# Altium project Main Nova.PrjPcb
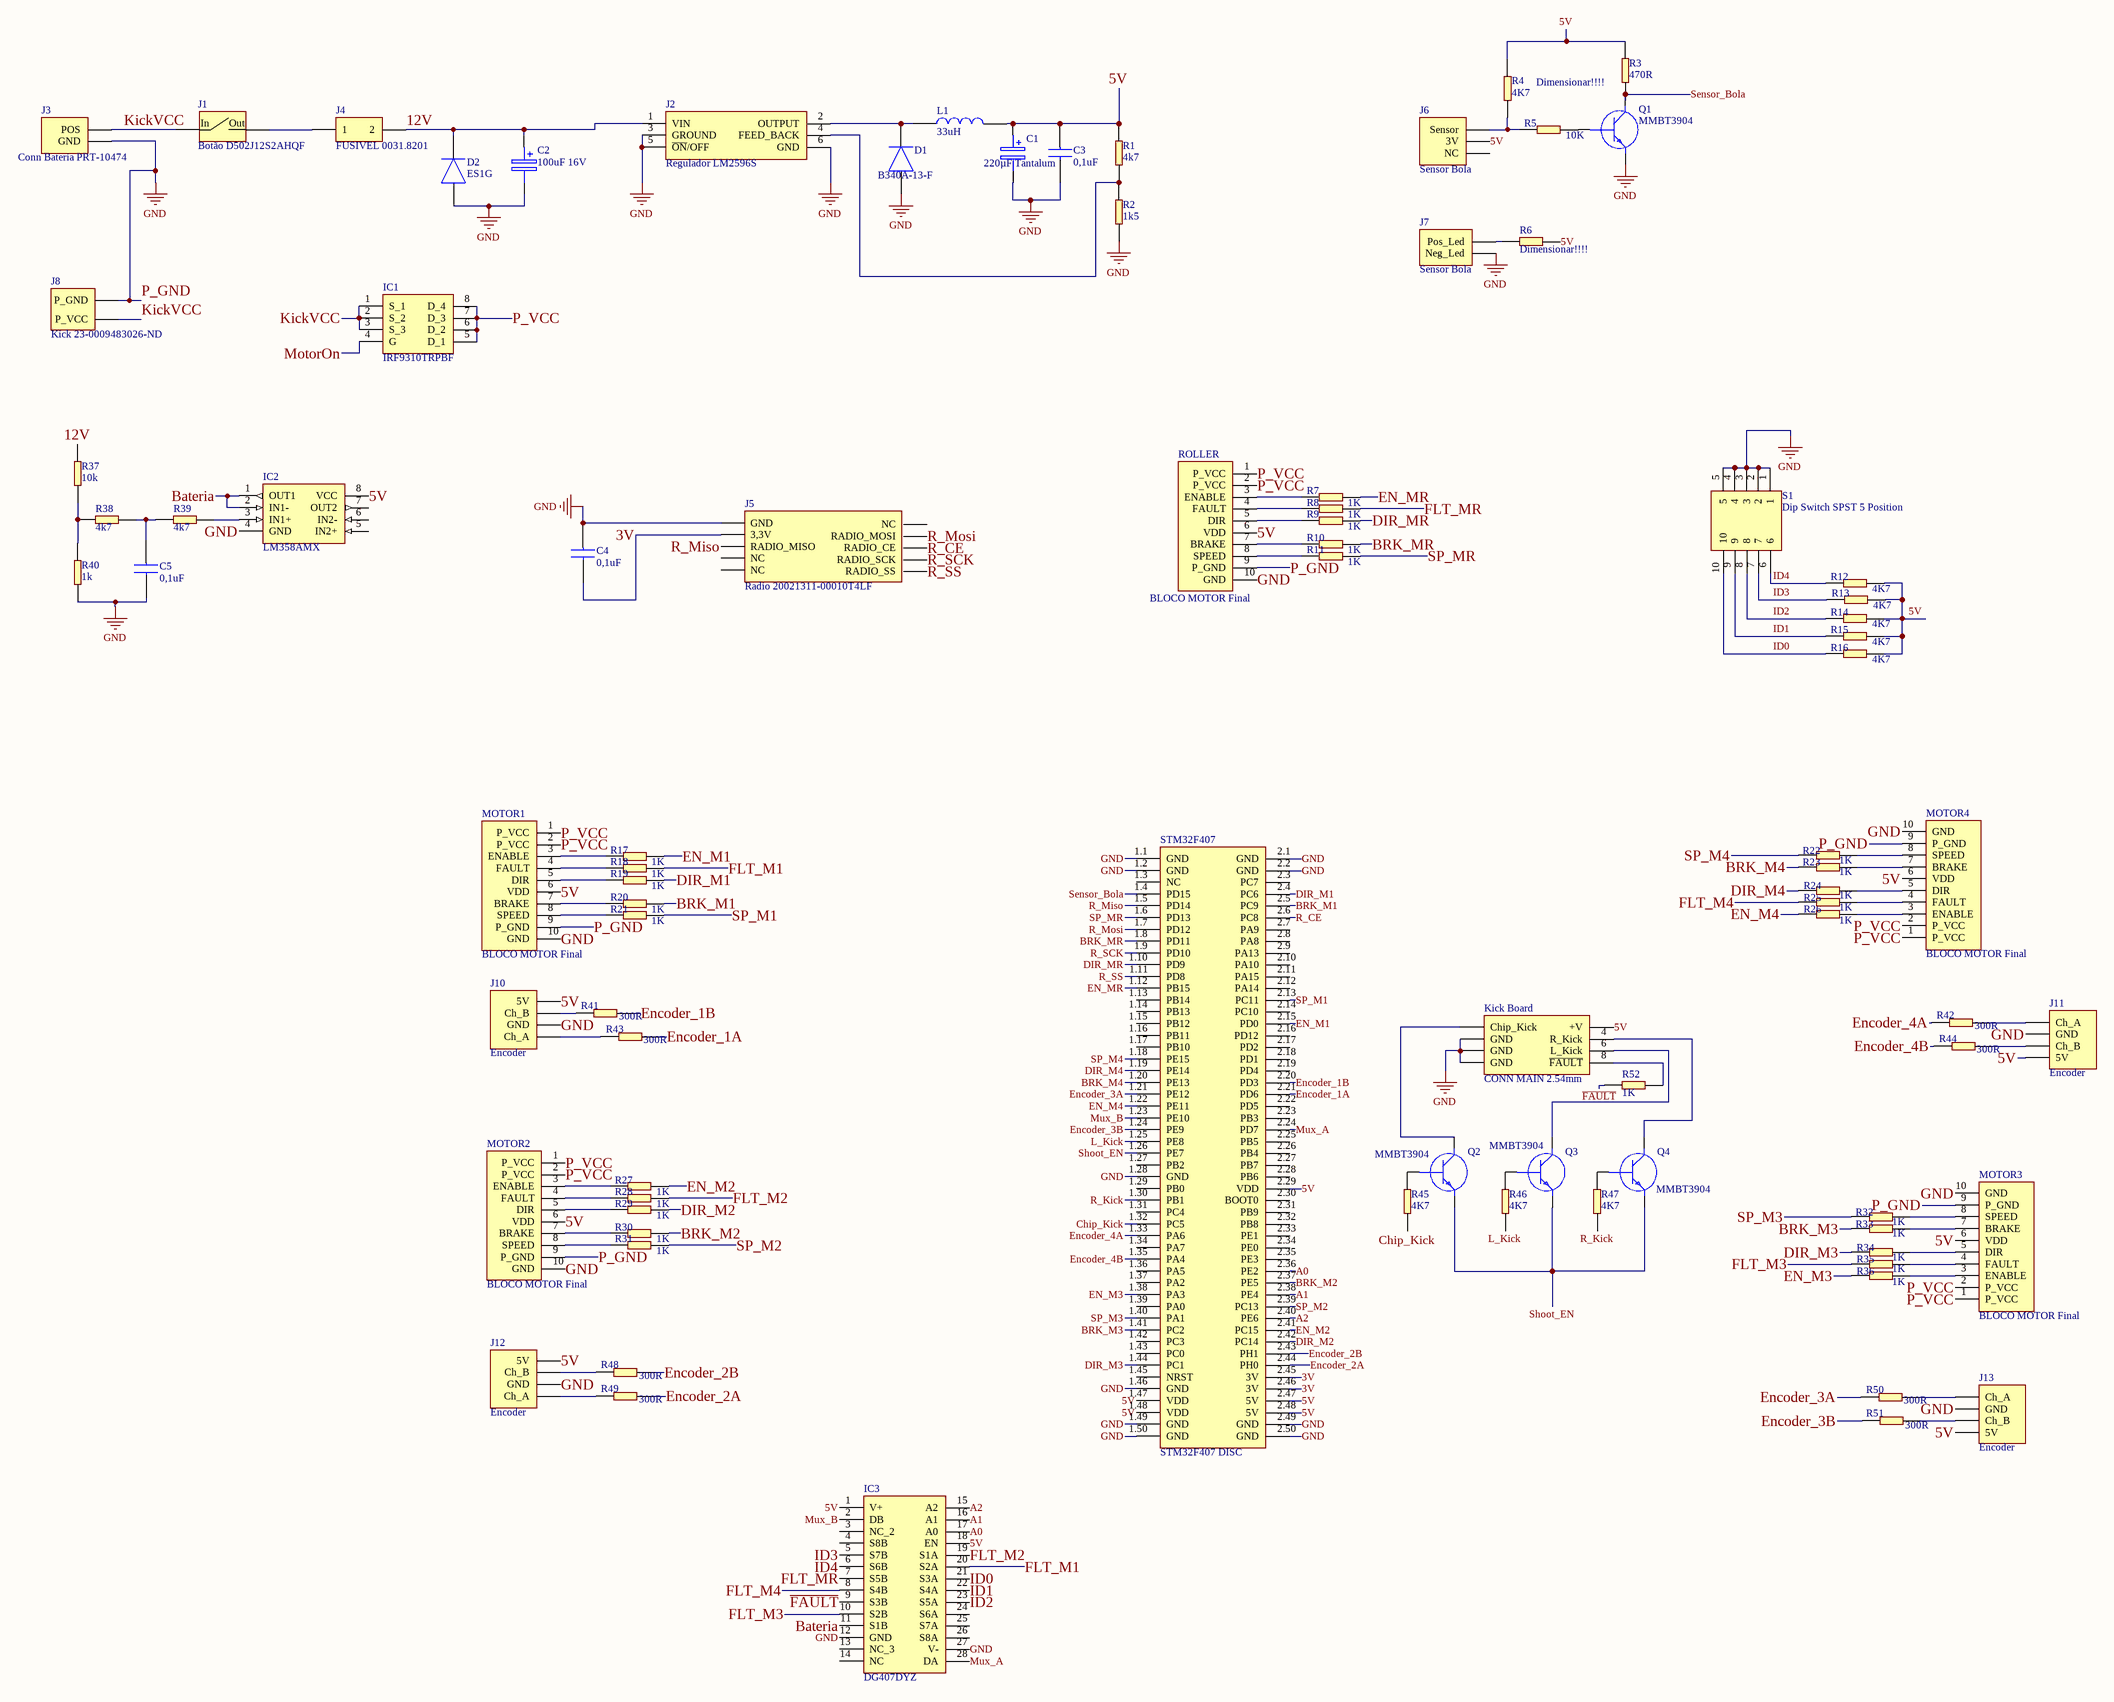
[diagram p0: Main.SchDoc]
1 sheet, 87 parts. Net scope: global (net labels, ports and power ports of the same name join across sheets).
Board file: Main.PcbDoc

## Sheet Main.SchDoc
size A2; System: Connector

### Parts
C1  220µF Tantalum  [CAP C2 SMD 6032 (2312)]
C2  100uF 16V  [C1 CAP ALUM SMD]
C3  0,1uF  [CAP C3 0603 SMD]
C4  0,1uF  [CAP C3 0603 SMD]
C5  0,1uF  [CAP C3 0603 SMD]
D1  B340A-13-F  [Diodo D1, D2]
D2  ES1G  [Diodo D1, D2]
IC1  IRF9310TRPBF  [Mosfet P_VCC]
IC2  LM358AMX  [OP AMP Bateria]
IC3  DG407DYZ  [MUX 2x 8:1]
J1  Botão D502J12S2AHQF  [Botão Bateria Main]
J2  Regulador LM2596S  [LM2596S50TR]
J3  Conn Bateria PRT-10474  [Conn Bateria Bolado]
J4  FUSIVEL 0031.8201  [PORTA FUSIVEL]
J5  Radio 20021311-00010T4LF  [CONN Radio]
J6  Sensor Bola  [Conn Receptor Infra]
J7  Sensor Bola  [Conn Emisor Infra]
J8  Kick 23-0009483026-ND  [Battery Main to Kick Connector]
J10  Encoder  [Conn Encoder]
J11  Encoder  [Conn Encoder]
J12  Encoder  [Conn Encoder]
J13  Encoder  [Conn Encoder]
Kick_Board  CONN MAIN 2.54mm  [Kick Board]
L1  33uH  [Indutor DR124-330-R]
MOTOR1  BLOCO MOTOR Final  [BlocoMotor Final]
MOTOR2  BLOCO MOTOR Final  [BlocoMotor Final]
MOTOR3  BLOCO MOTOR Final  [BlocoMotor Final]
MOTOR4  BLOCO MOTOR Final  [BlocoMotor Final]
Q1  MMBT3904  [Mini Transistor]
Q2  MMBT3904  [Mini Transistor]
Q3  MMBT3904  [Mini Transistor]
Q4  MMBT3904  [Mini Transistor]
R1  4k7  [RES 0805]
R2  1k5  [RES 0805]
R3  470R  [RES 0805]
R4  4K7  [RES 0805]
R5  10K  [RES 0805]
R6  Dimensionar!!!!  [RES 0805]
R7  1K  [RES 0805]
R8  1K  [RES 0805]
R9  1K  [RES 0805]
R10  1K  [RES 0805]
R11  1K  [RES 0805]
R12  4K7  [RES 0805]
R13  4K7  [RES 0805]
R14  4K7  [RES 0805]
R15  4K7  [RES 0805]
R16  4K7  [RES 0805]
R17  1K  [RES 0805]
R18  1K  [RES 0805]
R19  1K  [RES 0805]
R20  1K  [RES 0805]
R21  1K  [RES 0805]
R22  1K  [RES 0805]
R23  1K  [RES 0805]
R24  1K  [RES 0805]
R25  1K  [RES 0805]
R26  1K  [RES 0805]
R27  1K  [RES 0805]
R28  1K  [RES 0805]
R29  1K  [RES 0805]
R30  1K  [RES 0805]
R31  1K  [RES 0805]
R32  1K  [RES 0805]
R33  1K  [RES 0805]
R34  1K  [RES 0805]
R35  1K  [RES 0805]
R36  1K  [RES 0805]
R37  10k  [RES 0805]
R38  4k7  [RES 0805]
R39  4k7  [RES 0805]
R40  1k  [RES 0805]
R41  300R  [RES 0805]
R42  300R  [RES 0805]
R43  300R  [RES 0805]
R44  300R  [RES 0805]
R45  4K7  [RES 0805]
R46  4K7  [RES 0805]
R47  4K7  [RES 0805]
R48  300R  [RES 0805]
R49  300R  [RES 0805]
R50  300R  [RES 0805]
R51  300R  [RES 0805]
R52  1K  [RES 0805]
ROLLER  BLOCO MOTOR Final  [BlocoMotor Final]
S1  Dip Switch SPST 5 Position  [Dip Switch SPST 5 Position]
STM32F407  STM32F407 DISC  [STM32F407 DISC]

### Nets
GND: C1.2(-) C2.2(-) C3.2 C4.1 C5.2 D1.2(A) D2.2(A) IC2.4(GND) IC3.12(GND) IC3.27(V-) J2.3(GROUND) J2.5(~{ON}/OFF) J2.6(GND) J3.1(GND) J5.1(GND) J7.1(Neg_Led) J8.1(P_GND) J10.2(GND) J11.2(GND) J12.2(GND) J13.2(GND) Kick_Board.3(GND) Kick_Board.5(GND) Kick_Board.7(GND) MOTOR1.9(P_GND) MOTOR1.10(GND) MOTOR2.9(P_GND) MOTOR2.10(GND) MOTOR3.9(P_GND) MOTOR3.10(GND) MOTOR4.9(P_GND) MOTOR4.10(GND) Q1.2(E) R2.1 R40.1 ROLLER.9(P_GND) ROLLER.10(GND) S1.1 S1.2 S1.3 S1.4 S1.5 STM32F407.1.1(GND) STM32F407.1.2(GND) STM32F407.1.28(GND) STM32F407.1.46(GND) STM32F407.1.49(GND) STM32F407.1.50(GND) STM32F407.2.1(GND) STM32F407.2.2(GND) STM32F407.2.49(GND) STM32F407.2.50(GND)  [also labelled P_GND]
3V: C4.2 J5.2(3,3V) STM32F407.2.45(3V) STM32F407.2.46(3V)
5V: C1.1(+) C3.1 IC2.8(VCC) IC3.1(V+) IC3.18(EN) J6.2(3V) J10.4(5V) J11.4(5V) J12.4(5V) J13.4(5V) Kick_Board.2(+V) L1.2 MOTOR1.6(VDD) MOTOR2.6(VDD) MOTOR3.6(VDD) MOTOR4.6(VDD) R1.2 R3.1 R4.1 R6.2 R12.1 R13.1 R14.1 R15.1 R16.1 ROLLER.6(VDD) STM32F407.1.47(VDD) STM32F407.1.48(VDD) STM32F407.2.29(VDD) STM32F407.2.47(5V) STM32F407.2.48(5V)
12V: C2.1(+) D2.1(K) J2.1(VIN) J4.2 R37.2
A0: IC3.17(A0) STM32F407.2.36(PE2)
A1: IC3.16(A1) STM32F407.2.38(PE4)
A2: IC3.15(A2) STM32F407.2.40(PE6)
Bateria: IC2.1(OUT1) IC2.2(IN1-) IC3.11(S1B)
BRK_M1: R20.1 STM32F407.2.5(PC9)
BRK_M2: R30.1 STM32F407.2.37(PE5)
BRK_M3: R33.1 STM32F407.1.41(PC2)
BRK_M4: R23.1 STM32F407.1.20(PE13)
BRK_MR: R10.1 STM32F407.1.8(PD11)
Chip_Kick: R45.2 STM32F407.1.32(PC5)
DIR_M1: R19.1 STM32F407.2.4(PC6)
DIR_M2: R29.1 STM32F407.2.42(PC14)
DIR_M3: R34.1 STM32F407.1.44(PC1)
DIR_M4: R24.1 STM32F407.1.19(PE14)
DIR_MR: R9.1 STM32F407.1.10(PD9)
EN_M1: R17.1 STM32F407.2.15(PD0)
EN_M2: R27.1 STM32F407.2.41(PC15)
EN_M3: R36.1 STM32F407.1.38(PA3)
EN_M4: R26.1 STM32F407.1.22(PE11)
EN_MR: R7.1 STM32F407.1.12(PB15)
Encoder_1A: R43.1 STM32F407.2.21(PD6)
Encoder_1B: R41.1 STM32F407.2.20(PD3)
Encoder_2A: R49.1 STM32F407.2.44(PH0)
Encoder_2B: R48.1 STM32F407.2.43(PH1)
Encoder_3A: R50.2 STM32F407.1.21(PE12)
Encoder_3B: R51.2 STM32F407.1.24(PE9)
Encoder_4A: R42.2 STM32F407.1.33(PA6)
Encoder_4B: R44.2 STM32F407.1.35(PA4)
~{FAULT}: IC3.9(S3B) R52.2
FLT_M1: IC3.20(S2A) R18.1
FLT_M2: IC3.19(S1A) R28.1
FLT_M3: IC3.10(S2B) R35.1
FLT_M4: IC3.8(S4B) R25.1
FLT_MR: IC3.7(S5B) R8.1
ID0: IC3.21(S3A) R16.2 S1.10
ID1: IC3.22(S4A) R15.2 S1.9
ID2: IC3.23(S5A) R14.2 S1.8
ID3: IC3.5(S7B) R13.2 S1.7
ID4: IC3.6(S6B) R12.2 S1.6
KickVCC: IC1.1(S_1) IC1.2(S_2) IC1.3(S_3) J1.1(In) J3.2(POS) J8.2(P_VCC)
L_Kick: R46.2 STM32F407.1.25(PE8)
MotorOn: IC1.4(G)
Mux_A: IC3.28(DA) STM32F407.2.24(PD7)
Mux_B: IC3.2(DB) STM32F407.1.23(PE10)
P_VCC: IC1.5(D_1) IC1.6(D_2) IC1.7(D_3) IC1.8(D_4) MOTOR1.1(P_VCC) MOTOR1.2(P_VCC) MOTOR2.1(P_VCC) MOTOR2.2(P_VCC) MOTOR3.1(P_VCC) MOTOR3.2(P_VCC) MOTOR4.1(P_VCC) MOTOR4.2(P_VCC) ROLLER.1(P_VCC) ROLLER.2(P_VCC)
R_CE: J5.8(RADIO_CE) STM32F407.2.6(PC8)
R_Kick: R47.2 STM32F407.1.30(PB1)
R_Miso: J5.3(RADIO_MISO) STM32F407.1.5(PD14)
R_Mosi: J5.7(RADIO_MOSI) STM32F407.1.7(PD12)
R_SCK: J5.9(RADIO_SCK) STM32F407.1.9(PD10)
R_SS: J5.10(RADIO_SS) STM32F407.1.11(PD8)
Sensor_Bola: Q1.3(C) R3.2 STM32F407.1.4(PD15)
Shoot_EN: Q2.2(E) Q3.2(E) Q4.2(E) STM32F407.1.26(PE7)
SP_M1: R21.1 STM32F407.2.13(PC11)
SP_M2: R31.1 STM32F407.2.39(PC13)
SP_M3: R32.1 STM32F407.1.40(PA1)
SP_M4: R22.1 STM32F407.1.18(PE15)
SP_MR: R11.1 STM32F407.1.6(PD13)
NetC5_1: C5.1 R38.1 R39.2
NetD1_1: D1.1(K) J2.2(OUTPUT) L1.1
NetIC2_3: IC2.3(IN1+) R39.1
NetJ1_2: J1.2(Out) J4.1
NetJ2_4: J2.4(FEED_BACK) R1.1 R2.2
NetJ6_3: J6.3(Sensor) R4.2 R5.2
NetJ7_2: J7.2(Pos_Led) R6.1
NetJ10_1: J10.1(Ch_A) R43.2
NetJ10_3: J10.3(Ch_B) R41.2
NetJ11_1: J11.1(Ch_A) R42.1
NetJ11_3: J11.3(Ch_B) R44.1
NetJ12_1: J12.1(Ch_A) R49.2
NetJ12_3: J12.3(Ch_B) R48.2
NetJ13_1: J13.1(Ch_A) R50.1
NetJ13_3: J13.3(Ch_B) R51.1
NetKick_Board_1: Kick_Board.1(Chip_Kick) Q2.3(C)
NetKick_Board_4: Kick_Board.4(R_Kick) Q4.3(C)
NetKick_Board_6: Kick_Board.6(L_Kick) Q3.3(C)
NetKick_Board_8: Kick_Board.8(~{FAULT}) R52.1
NetMOTOR1_3: MOTOR1.3(ENABLE) R17.2
NetMOTOR1_4: MOTOR1.4(FAULT) R18.2
NetMOTOR1_5: MOTOR1.5(DIR) R19.2
NetMOTOR1_7: MOTOR1.7(BRAKE) R20.2
NetMOTOR1_8: MOTOR1.8(SPEED) R21.2
NetMOTOR2_3: MOTOR2.3(ENABLE) R27.2
NetMOTOR2_4: MOTOR2.4(FAULT) R28.2
NetMOTOR2_5: MOTOR2.5(DIR) R29.2
NetMOTOR2_7: MOTOR2.7(BRAKE) R30.2
NetMOTOR2_8: MOTOR2.8(SPEED) R31.2
NetMOTOR3_3: MOTOR3.3(ENABLE) R36.2
NetMOTOR3_4: MOTOR3.4(FAULT) R35.2
NetMOTOR3_5: MOTOR3.5(DIR) R34.2
NetMOTOR3_7: MOTOR3.7(BRAKE) R33.2
NetMOTOR3_8: MOTOR3.8(SPEED) R32.2
NetMOTOR4_3: MOTOR4.3(ENABLE) R26.2
NetMOTOR4_4: MOTOR4.4(FAULT) R25.2
NetMOTOR4_5: MOTOR4.5(DIR) R24.2
NetMOTOR4_7: MOTOR4.7(BRAKE) R23.2
NetMOTOR4_8: MOTOR4.8(SPEED) R22.2
NetQ1_1: Q1.1(B) R5.1
NetQ2_1: Q2.1(B) R45.1
NetQ3_1: Q3.1(B) R46.1
NetQ4_1: Q4.1(B) R47.1
NetR7_2: R7.2 ROLLER.3(ENABLE)
NetR8_2: R8.2 ROLLER.4(FAULT)
NetR9_2: R9.2 ROLLER.5(DIR)
NetR10_2: R10.2 ROLLER.7(BRAKE)
NetR11_2: R11.2 ROLLER.8(SPEED)
NetR37_1: R37.1 R38.2 R40.2

Not connected (* = marked no-connect by the designer): IC2 5(IN2+) 6(IN2-) 7(OUT2); IC3 3(NC_2) 4(S8B) 13(NC_3) 14(NC) 24(S6A) 25(S7A) 26(S8A); J5 4(NC) 5(NC) 6(NC); J6 1(NC); STM32F407 1.3(NC) 1.13(PB14) 1.14(PB13) 1.15(PB12) 1.16(PB11) 1.17(PB10) 1.27(PB2) 1.29(PB0) 1.31(PC4) 1.34(PA7) 1.36(PA5) 1.37(PA2) 1.39(PA0) 1.42(PC3) 1.43(PC0) 1.45(NRST) 2.3(PC7) 2.7(PA9) 2.8(PA8) 2.9(PA13) 2.10(PA10) 2.11(PA15) 2.12(PA14) 2.14(PC10) 2.16(PD12) 2.17(PD2) 2.18(PD1) 2.19(PD4) 2.22(PD5) 2.23(PB3) 2.25(PB5) 2.26(PB4) 2.27(PB7) 2.28(PB6) 2.30(BOOT0) 2.31(PB9) 2.32(PB8) 2.33(PE1) 2.34(PE0) 2.35(PE3)

### Notes on the sheet
- Dimensionar!!!!

### Library data of the parts
C1 = CAP C2 Tantalum: 220µF Molded Tantalum Capacitors 6.3V 2312 (6032 Metric) 125mOhm / TPSC227M006R0125 / 478-5239-1-ND /; Manufacturer_Name: Panasonic; Manufacturer_Part_Number: EEE-FK1E101P; Allied_Number: 70258245; Datasheet Link: https://industrial.panasonic.com/cdbs/www-data/pdf/RDE0000/ABA0000C1181.pdf; Height: 6.5mm; Mouser Part Number: 667-EEE-FK1E101P; Mouser Price/Stock: https://www.mouser.com/Search/Refine.aspx?Keyword=667-EEE-FK1E101P; Allied Price/Stock: https://www.alliedelec.com/panasonic-eee-fk1e101p/70258245/
C2 = C1 CAP ALUM 16V EEE-1CA101WP: 100µF 16V Aluminum Electrolytic Capacitors Radial, Can - SMD  1000 Hrs @ 85°C / PCE3880CT-ND / EEE-1CA101WP; Manufacturer_Name: Panasonic; Allied_Number: 70257932; Datasheet Link: https://industrial.panasonic.com/cdbs/www-data/pdf/RDE0000/ABA0000C1145.pdf; Height: 6.1mm; Manufacturer_Part_Number: EEE-1CA101WP; Mouser Part Number: 667-EEE-1CA101WP; Mouser Price/Stock: https://www.mouser.com/Search/Refine.aspx?Keyword=667-EEE-1CA101WP; RS Part Number: 8077884; RS Price/Stock: https://uk.rs-online.com/web/p/products/8077884; Allied Price/Stock: https://www.alliedelec.com/panasonic-eee-1ca101wp/70257932/
C3-C5 = CAP C3 0603: 0.1µF -20%, +80% 50V Ceramic Capacitor Y5V (F) 0603 (1608 Metric) / C1608Y5V1H104Z / 445-1324-1-ND; Manufacturer_Name: TDK; Manufacturer_Part_Number: C3216C0G1H103J060AA; Datasheet Link: https://product.tdk.com/info/en/catalog/datasheets/mlcc_commercial_midvoltage_en.pdf; Height: 0.75mm; Mouser Part Number: 810-C3216C0G1H103J-1; Mouser Price/Stock: https://www.mouser.com/Search/Refine.aspx?Keyword=810-C3216C0G1H103J-1; RS Part Number: 7407467P; RS Price/Stock: http://uk.rs-online.com/web/p/products/7407467P
D1 = Diodo D2 B340A-13-F: Diode Schottky 40V 3A Surface Mount SMA / B340A-FDITR-ND / B340A-13-F; Manufacturer_Name: Diodes Inc.; Manufacturer_Part_Number: ES1G; Datasheet Link: https://www.diodes.com/assets/Datasheets/ds14001.pdf; Height: 2.4mm; Mouser Part Number: N/A; Mouser Price/Stock: https://www.mouser.com/Search/ProductDetail.aspx?qs=T8kGKSMx1V6viEjwVgaU9A%3d%3d
D2 = Diodo D1 ES1G: Diode Standard 400V 1A Surface Mount SMA (DO-214AC) / S1GFSCT-ND; Manufacturer_Name: Diodes Inc.; Datasheet Link: https://www.diodes.com/assets/Datasheets/ds14001.pdf; Height: 2.4mm; Manufacturer_Part_Number: ES1G; Mouser Part Number: N/A; Mouser Price/Stock: https://www.mouser.com/Search/ProductDetail.aspx?qs=T8kGKSMx1V6viEjwVgaU9A%3d%3d
IC1 = Mosfet P_VCC: MOSFET P-CH 30V 20A 8-SOIC / P-Channel 30V 20A (Tc) 2.5W (Ta) Surface Mount 8-SO / IRF9310TRPBF / IRF9310TRPBFTR-ND; Manufacturer_Name: Infineon; Manufacturer_Part_Number: IRF9310PBF; Allied_Number: 70019233; Datasheet Link: http://www.farnell.com/datasheets/2040382.pdf; Height: 1.75mm; Mouser Part Number: 942-IRF9310PBF; Mouser Price/Stock: https://www.mouser.com/Search/Refine.aspx?Keyword=942-IRF9310PBF; RS Part Number: 7259234P; RS Price/Stock: http://uk.rs-online.com/web/p/products/7259234P; Allied Price/Stock: https://www.alliedelec.com/infineon-irf9310pbf/70019233/
IC2 = OP AMP Bateria: IC OPAMP GP 2 CIRCUIT 8SOIC / General Purpose Amplifier 2 Circuit  8-SOIC / LM358AMXFSCT-ND / LM358AMX; Manufacturer_Name: ON Semiconductor; Datasheet Link: http://docs-emea.rs-online.com/webdocs/10c0/0900766b810c0a50.pdf; Height: 1.75mm; Manufacturer_Part_Number: LM358AMX; Mouser Part Number: 512-LM358AMX; Mouser Price/Stock: https://www.mouser.com/Search/Refine.aspx?Keyword=512-LM358AMX; RS Part Number: 7599399P; RS Price/Stock: http://uk.rs-online.com/web/p/products/7599399P
IC3 = MUX 2x 8:1: IC MULTIPLEXER DUAL 8X1 28SOIC / 2 Circuit IC Switch 8:1 100Ohm 28-SOIC / DG407DYZ; Manufacturer_Name: Intersil; Manufacturer_Part_Number: DG407DYZ; Mouser Part Number: 968-DG407DYZ; Mouser Price/Stock: http://www.mouser.com/Search/ProductDetail.aspx?qs=cbl4%252bYHJGOHwHxaVU1fONg%3d%3d
J1 = Botão Bateria Main: Rocker Switch SPST 10A (AC) 125V Panel Mount, Snap-In, Right Angle / D502J12S2AHQF / CKN2058-ND /; Manufacturer_Name: SCHURTER; Manufacturer_Part_Number: 0031.8201; Datasheet Link: http://www.schurter.com.hk/var/schurter/storage/ilcatalogue/files/document/datasheet/en/pdf/typ_OGN.pdf; Mouser Part Number: 693-0031.8201; Mouser Price/Stock: https://www.mouser.com/Search/Refine.aspx?Keyword=693-0031.8201; RS Part Number: 2508764386; RS Price/Stock: http://uk.rs-online.com/web/p/products/2508764386
J2 = Regulador LM2596S 12V - 5V: Buck Switching Regulator IC Positive Adjustable 1.2V 1 Output 3A TO-263-6, D²Pak (5 Leads + Tab), TO-263BA / LM2596S-ADJ; Manufacturer_Name: National Electronics; Manufacturer_Part_Number: LM2596S-5.0/TR; Datasheet Link: https://www.jameco.com/Jameco/Products/ProdDS/895246.pdf; Height: 4.65mm
J3 = Conn Bateria Bolado: XT60 CONNECTORS MALE / PRT-10474 / 1568-1816-ND; Manufacturer_Name: SparkFun; Datasheet Link: http://cdn.sparkfun.com/datasheets/Prototyping/xt60.pdf; Height: 15.875mm; Manufacturer_Part_Number: PRT-10474; Mouser Part Number: 474-PRT-10474; Mouser Price/Stock: https://www.mouser.com/Search/Refine.aspx?Keyword=474-PRT-10474
J4 = PORTA FUSIVEL 0031.8201: Fuse Block 10A 500V 1 Circuit Cartridge Through Hole / 486-1258-ND / 0031.8201; Manufacturer_Name: SCHURTER; Datasheet Link: http://www.schurter.com.hk/var/schurter/storage/ilcatalogue/files/document/datasheet/en/pdf/typ_OGN.pdf; Manufacturer_Part_Number: 0031.8201; Mouser Part Number: 693-0031.8201; Mouser Price/Stock: https://www.mouser.com/Search/Refine.aspx?Keyword=693-0031.8201; RS Part Number: 2508764386; RS Price/Stock: http://uk.rs-online.com/web/p/products/2508764386
J5 = CONN RADIO: CONN RCPT 1.27mm 10POS 0.05 GOLD PCB / 20021311-00010T4LF / 609-3754-ND; Manufacturer_Name: FCI; Datasheet Link: http://portal.fciconnect.com/Comergent//fci/drawing/20021311.pdf; Height: 4.6mm; Manufacturer_Part_Number: 20021311-00010T4LF; Mouser Part Number: 649-221311-00010T4LF; Mouser Price/Stock: https://www.mouser.com/Search/Refine.aspx?Keyword=649-221311-00010T4LF
J6 = Conn Receptor Infra: Connector Header Through Hole 3 position 0.079" (2.00mm) / CONN HEADER VERT 3POS 2MM / 0353620350 / WM18921-ND; Manufacturer_Name: TE Connectivity; Manufacturer_Part_Number: 292161-3; Allied_Number: 70083930; Datasheet Link: http://www.te.com/commerce/DocumentDelivery/DDEController?Action=showdoc&DocId=Customer+Drawing%7F292161%7FP1%7Fpdf%7FEnglish%7FENG_CD_292161_P1.pdf%7F292161-3; Height: 6.8mm; Mouser Part Number: 571-292161-3; Mouser Price/Stock: https://www.mouser.com/Search/Refine.aspx?Keyword=571-292161-3; RS Part Number: 6801610; RS Price/Stock: https://uk.rs-online.com/web/p/products/6801610; Allied Price/Stock: https://www.alliedelec.com/te-connectivity-292161-3/70083930/
J7 = Conn Emissor Infra: Connector Header Through Hole 2 position 0.079" (2.00mm) / CONN HEADER VERT 3POS 2MM / 0353620350 / WM18921-ND; Manufacturer_Name: TE Connectivity; Manufacturer_Part_Number: 292161-3; Allied_Number: 70083930; Datasheet Link: http://www.te.com/commerce/DocumentDelivery/DDEController?Action=showdoc&DocId=Customer+Drawing%7F292161%7FP1%7Fpdf%7FEnglish%7FENG_CD_292161_P1.pdf%7F292161-3; Height: 6.8mm; Mouser Part Number: 571-292161-3; Mouser Price/Stock: https://www.mouser.com/Search/Refine.aspx?Keyword=571-292161-3; RS Part Number: 6801610; RS Price/Stock: https://uk.rs-online.com/web/p/products/6801610; Allied Price/Stock: https://www.alliedelec.com/te-connectivity-292161-3/70083930/
J8 = Battery Main to Kick: 23-0009483026-ND; Manufacturer_Name: Molex; Allied_Number: 70190620; System: Connector; Datasheet Link: http://www.molex.com/webdocs/datasheets/pdf/en-us/0022053031_PCB_HEADERS.pdf; Manufacturer_Part_Number: 22-05-3021; Mouser Part Number: 538-22-05-3021; Mouser Price/Stock: https://www.mouser.com/Search/Refine.aspx?Keyword=538-22-05-3021; RS Part Number: 6795448; RS Price/Stock: https://uk.rs-online.com/web/p/products/6795448; Allied Price/Stock: https://www.alliedelec.com/molex-incorporated-22-05-3021/70190620/
J10-J13 = Conn Encoder: Connector Header Through Hole 4 position 0.079" (2.00mm) / CONN HEADER VERT 3POS 2MM / 0353620350 / WM18921-ND; Manufacturer_Name: TE Connectivity; Manufacturer_Part_Number: 292161-3; Allied_Number: 70083930; Datasheet Link: http://www.te.com/commerce/DocumentDelivery/DDEController?Action=showdoc&DocId=Customer+Drawing%7F292161%7FP1%7Fpdf%7FEnglish%7FENG_CD_292161_P1.pdf%7F292161-3; Height: 6.8mm; Mouser Part Number: 571-292161-3; Mouser Price/Stock: https://www.mouser.com/Search/Refine.aspx?Keyword=571-292161-3; RS Part Number: 6801610; RS Price/Stock: https://uk.rs-online.com/web/p/products/6801610; Allied Price/Stock: https://www.alliedelec.com/te-connectivity-292161-3/70083930/
Kick_Board = Kick Board: Connector / CONN HEADER VERT 8POS 2.54MM / M20-9980445 / 952-2122-ND; Manufacturer_Name: FCI; Manufacturer_Part_Number: 20021311-00010T4LF; Datasheet Link: http://portal.fciconnect.com/Comergent//fci/drawing/20021311.pdf; Height: 4.6mm; Mouser Part Number: 649-221311-00010T4LF; Mouser Price/Stock: https://www.mouser.com/Search/Refine.aspx?Keyword=649-221311-00010T4LF; System: Connector
L1 = Indutor DR124-221-R: 33µH Shielded Wirewound Inductor 2.6A 97mOhm Max Nonstandard / DR124-330-R / 513-1435-1-ND; Manufacturer_Name: Cooper Bussmann; Datasheet Link: http://www.cooperindustries.com/content/dam/public/bussmann/Electronics/Resources/product-datasheets/Bus_Elx_DS_PM-4141_DR124.pdf; Manufacturer_Part_Number: DR124-221-R; RS Part Number: 7700915; RS Price/Stock: https://uk.rs-online.com/web/p/products/7700915
MOTOR1-MOTOR4 ROLLER = BLOCO MOTOR Final: System: Connector
Q1-Q4 = Mini_Transistor: Bipolar (BJT) Transistor NPN 40V 200mA 300MHz 350mW Surface Mount SOT-23-3 / MMBT3904 / MMBT3904FSCT-ND; Manufacturer_Name: ON Semiconductor; Datasheet Link: https://www.fairchildsemi.com/datasheets/MM/MMBT3904.pdf; Height: 0.93mm; Manufacturer_Part_Number: MMBT3904; Mouser Part Number: 512-MMBT3904; Mouser Price/Stock: https://www.mouser.com/Search/Refine.aspx?Keyword=512-MMBT3904; RS Part Number: 7390303P; RS Price/Stock: http://uk.rs-online.com/web/p/products/7390303P
R1-R52 = Resistor 0805: Resistor; Manufacturer_Name: TE Connectivity; Manufacturer_Part_Number: CPF0805B105RE1; Datasheet Link: http://docs-europe.electrocomponents.com/webdocs/13d1/0900766b813d116f.pdf; Height: 0.65mm; Mouser Part Number: 279-CPF0805B105RE1; Mouser Price/Stock: https://www.mouser.com/Search/Refine.aspx?Keyword=279-CPF0805B105RE1; RS Part Number: 1239398; RS Price/Stock: http://uk.rs-online.com/web/p/products/1239398
S1 = Dip Switch SPST 5 Position: CT2065-ND / 206-5 / Dip Switch SPST 5 Position Through Hole Slide (Standard) Actuator 50mA 24VDC; Manufacturer_Name: TE Connectivity; Manufacturer_Part_Number: 1825002-9; Datasheet Link: http://uk.rs-online.com/web/p/products/7182102P; Height: 4.81mm; RS Part Number: 7182102P; RS Price/Stock: http://uk.rs-online.com/web/p/products/7182102P